# Altium schematic sheet joint_board_boosterpack_load_cell.SchDoc
size A; DocumentNumber: 4
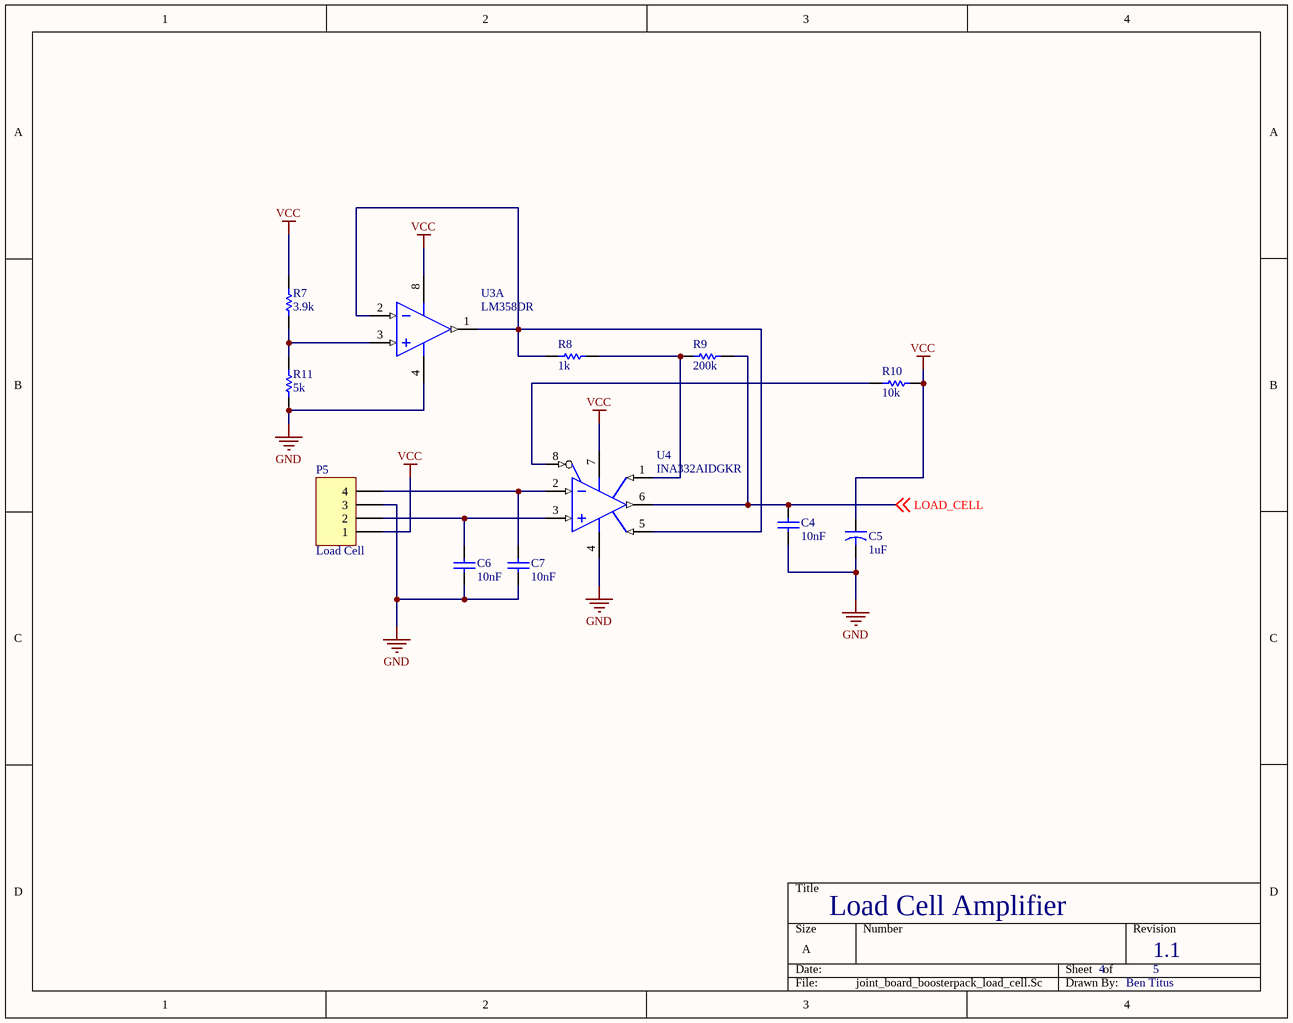
[diagram p0: joint_board_boosterpack_load_cell.SchDoc]

## Parts
C4  10nF  [CAPC0805(2012)145_L]
C5  1uF  [CAPR5-4X5]
C6  10nF  [CAPC0805(2012)145_L]
C7  10nF  [CAPC0805(2012)145_L]
P5  Load Cell  [HDR1X4]
R7  3.9k  [RESC0805(2012)_L]
R8  1k  [RESC0805(2012)_L]
R9  200k  [RESC0805(2012)_L]
R10  10k  [RESC0805(2012)_L]
R11  5k  [RESC0805(2012)_L]
U3  LM358DR  [D0008A_L]  (part A of 2)
U4  INA332AIDGKR  [DGK0008A_M]

## Nets
GND: C4.1 C5.2 C6.1 C7.1 P5.3 R11.1 U3.4(GND) U4.4(V-)
VCC: C5.1 P5.1 R7.2 R10.1 U3.8(VCC) U4.7(V+)
LOAD_CELL: C4.2 R9.2 U4.6(VOUT) ; off-sheet LOAD_CELL
NetC6_2: C6.2 P5.2 U4.3(VIN+)
NetC7_2: C7.2 P5.4 U4.2(VIN-)
NetR7_1: R7.1 R11.2 U3.3(1IN+)
NetR8_1: R8.1 U3.1(1OUT) U3.2(1IN-) U4.5(REF)
NetR8_2: R8.2 R9.1 U4.1(RG)
NetR10_2: R10.2 U4.8(SHUTDOWN)

## Notes on the sheet
- Load Cell Amplifier
- 4
- 1.1
- 5
- Ben Titus

## Library data of the parts
C4 C6 C7 = CMP-1590-00003-1: 0805 (2012 Metric) Chip Capacitor; Case-EIA: 0805; Case-Metric: 2012; PackageReference: CAPC0805(2012)145
C5 = Cap2: Capacitor; Published: 23-Sep-2002; PackageReference: CAPR5-4X5; Publisher: Altium Limited; PackageDescription: Capacitor; 2 Leads; Value: 1uF
P5 = Header 4: Header, 4-Pin; LatestRevisionDate: 17-Jul-2002; LatestRevisionNote: Re-released for DXP Platform.; Publisher: Altium Limited
R7-R11 = CMP-1591-00002-1: 0805 (2012 Metric) Chip Resistor; Case-EIA: 0805; Case-Metric: 2012; PackageReference: RESC0805(2012)
U3 = CMP-1685-00009-1: Dual Operational Amplifier, 3 to 32 V, 0 to 70 degC, 8-Pin SOIC (D), Green (RoHS & no Sb/Br), Tape and Reel; DatasheetVersion: SLOS068T, 04/2015; ComponentLink1URL: http://www.ti.com/; ComponentLink2URL: http://www.ti.com/lit/ds/symlink/lm358.pdf; ComponentLink3Description: Package Specification; Code_JEDEC: MS-012; PackageDescription: 8-Pin Small Outline Integrated Circuit, Body 4.9 x 3.9 mm, Pitch 1.27 mm; ComponentLink2Description: Datasheet; PackageVersion: 4040047-3/M, 06/2011; ComponentLink1Description: Manufacturer URL; ComponentLink3URL: http://www.ti.com/lit/ml/msoi002j/msoi002j.pdf; PackageReference: D0008A
U4 = CMP-0944-00077-2: Low-Power, Single Supply, CMOS, Low Cost, Instrumentation Amplifier, -55 to 125 degC, 8-pin SOP (DGK8), Green (RoHS & no Sb/Br); Manufacturer: Texas Instruments; Noise at 1kHz(Typ)(nV/rt(Hz)): 46; Quiescent Current (+/-)(Typ)(mA): 0.415; Gain(V/V): 5 to 1000; Vs(Min)(V): 2.5; Number of Channels: 1; Vs(Max)(V): 5.5; CMRR(Min)(dB): 60; Input Bias Current (+/-)(Max)(nA): 0.01; Input Offset (+/-)(Max)(uV): 8000; DatasheetVersion: SBOS216B; ComponentLink3URL: http://www.ti.com/litv/pdf/mpds028d; PartNumber: INA332AIDGKR; ComponentLink2Description: Datasheet; ComponentLink1URL: http://www.ti.com/; ComponentLink1Description: Manufacturer URL; Code_JEDEC: MO-187; SubFamily: Single Supply; ComponentLink3Description: Package Specification; Mounting Technology: Surface Mount; PackageReference: DGK0008A; PackageDescription: 8-Pin Thin Small Outline, Body 3 x 3 mm, Pitch 0.65 mm; PackageVersion: 4073329/E, 05/2006; Eco-Plan: Green (RoHS & no Sb/Br); Non-Linearity (+/-)(Max)(%): 0.01; ComponentLink2URL: http://www.ti.com/general/docs/lit/getliterature.tsp?genericPartNumber=INA332&fileType=pdf